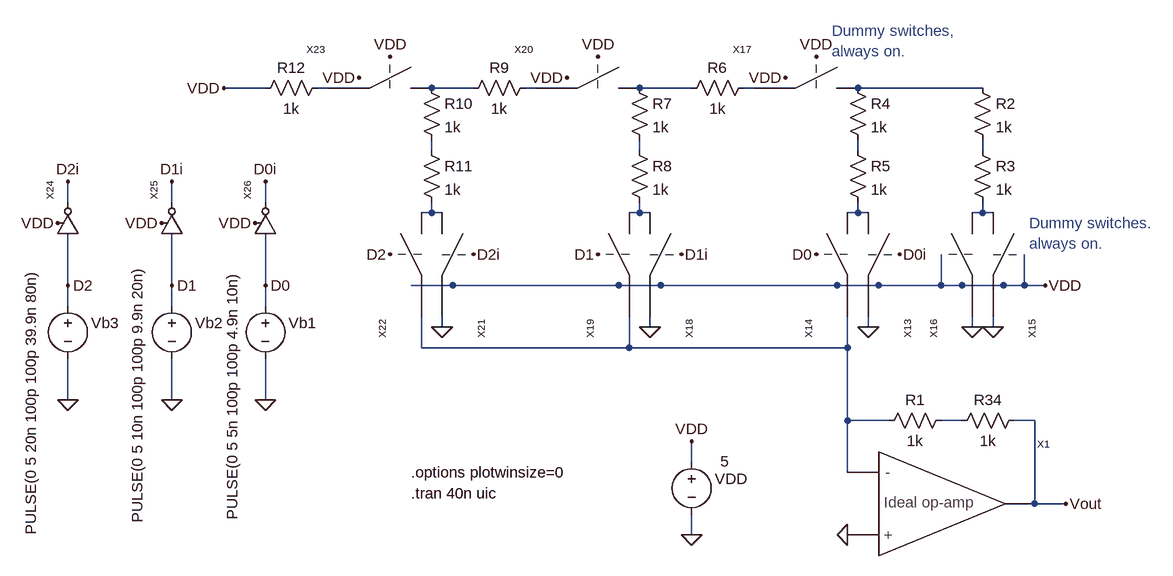
[diagram p0: schematic Fig29_8.asc]
Fig29_8.asc, the LTspice schematic file:
Version 4
SHEET 1 2492 2056
WIRE 688 960 624 960
WIRE 784 960 768 960
WIRE 1008 960 944 960
WIRE 1104 960 1088 960
WIRE 1344 960 1264 960
WIRE 1440 960 1424 960
WIRE 1792 960 1600 960
WIRE 944 1056 944 1040
WIRE 1264 1056 1264 1040
WIRE 1600 1056 1600 1040
WIRE 1792 1056 1792 1040
WIRE 384 1136 384 1104
WIRE 544 1136 544 1104
WIRE 688 1136 688 1104
WIRE 944 1152 944 1136
WIRE 944 1152 928 1152
WIRE 960 1152 944 1152
WIRE 1264 1152 1264 1136
WIRE 1264 1152 1248 1152
WIRE 1280 1152 1264 1152
WIRE 1600 1152 1600 1136
WIRE 1600 1152 1584 1152
WIRE 1616 1152 1600 1152
WIRE 1792 1152 1792 1136
WIRE 1792 1152 1776 1152
WIRE 1808 1152 1792 1152
WIRE 384 1264 384 1184
WIRE 544 1264 544 1184
WIRE 688 1264 688 1184
WIRE 976 1264 912 1264
WIRE 1232 1264 976 1264
WIRE 1296 1264 1232 1264
WIRE 1568 1264 1296 1264
WIRE 1632 1264 1568 1264
WIRE 1728 1264 1728 1216
WIRE 1728 1264 1632 1264
WIRE 1760 1264 1728 1264
WIRE 1824 1264 1760 1264
WIRE 1856 1264 1856 1216
WIRE 1856 1264 1824 1264
WIRE 1888 1264 1856 1264
WIRE 384 1296 384 1264
WIRE 544 1296 544 1264
WIRE 688 1296 688 1264
WIRE 960 1328 960 1312
WIRE 1280 1328 1280 1312
WIRE 1616 1328 1616 1312
WIRE 1776 1328 1776 1312
WIRE 1808 1328 1808 1312
WIRE 928 1360 928 1312
WIRE 1248 1360 1248 1312
WIRE 1248 1360 928 1360
WIRE 1584 1360 1584 1312
WIRE 1584 1360 1248 1360
WIRE 384 1440 384 1376
WIRE 544 1440 544 1376
WIRE 688 1440 688 1376
WIRE 1584 1472 1584 1360
WIRE 1648 1472 1584 1472
WIRE 1760 1472 1728 1472
WIRE 1872 1472 1840 1472
WIRE 1344 1536 1344 1504
WIRE 1584 1552 1584 1472
WIRE 1872 1600 1872 1472
WIRE 1920 1600 1872 1600
WIRE 1344 1648 1344 1616
FLAG 1344 1648 0
FLAG 1344 1504 VDD
FLAG 1584 1648 0
FLAG 1920 1600 Vout
FLAG 1536 1216 D0
FLAG 1664 1216 D0i
FLAG 1808 1328 0
FLAG 1776 1328 0
FLAG 1616 1328 0
FLAG 1488 944 VDD
FLAG 1536 912 VDD
FLAG 1200 1216 D1
FLAG 1328 1216 D1i
FLAG 1280 1328 0
FLAG 1152 944 VDD
FLAG 1200 912 VDD
FLAG 880 1216 D2
FLAG 1008 1216 D2i
FLAG 960 1328 0
FLAG 832 944 VDD
FLAG 880 912 VDD
FLAG 1888 1264 VDD
FLAG 624 960 VDD
FLAG 688 1440 0
FLAG 544 1440 0
FLAG 384 1440 0
FLAG 688 1264 D0
FLAG 544 1264 D1
FLAG 384 1264 D2
FLAG 368 1168 VDD
FLAG 384 1104 D2i
FLAG 528 1168 VDD
FLAG 544 1104 D1i
FLAG 672 1168 VDD
FLAG 688 1104 D0i
SYMBOL voltage 1344 1520 R0
WINDOW 0 36 42 Left 0
WINDOW 3 44 15 Left 0
WINDOW 123 0 0 Left 0
WINDOW 39 0 0 Left 0
SYMATTR InstName VDD
SYMATTR Value 5
SYMBOL Ideal_op_amp 1632 1600 R0
SYMATTR InstName X1
SYMBOL res 1632 1488 R270
WINDOW 0 32 56 VTop 0
WINDOW 3 0 56 VBottom 0
SYMATTR InstName R1
SYMATTR Value 1k
SYMBOL res 1776 944 R0
SYMATTR InstName R2
SYMATTR Value 1k
SYMBOL res 1776 1040 R0
SYMATTR InstName R3
SYMATTR Value 1k
SYMBOL res 1584 944 R0
SYMATTR InstName R4
SYMATTR Value 1k
SYMBOL res 1584 1040 R0
SYMATTR InstName R5
SYMATTR Value 1k
SYMBOL switch_1 1600 1152 R90
SYMATTR InstName X13
SYMBOL switch_1 1600 1152 M90
SYMATTR InstName X14
SYMBOL switch_1 1792 1152 R90
SYMATTR InstName X15
SYMBOL switch_1 1792 1152 M90
SYMATTR InstName X16
SYMBOL res 1328 976 R270
WINDOW 0 32 56 VTop 0
WINDOW 3 0 56 VBottom 0
SYMATTR InstName R6
SYMATTR Value 1k
SYMBOL switch_1 1600 976 M0
SYMATTR InstName X17
SYMBOL res 1248 944 R0
SYMATTR InstName R7
SYMATTR Value 1k
SYMBOL res 1248 1040 R0
SYMATTR InstName R8
SYMATTR Value 1k
SYMBOL switch_1 1264 1152 R90
SYMATTR InstName X18
SYMBOL switch_1 1264 1152 M90
SYMATTR InstName X19
SYMBOL res 992 976 R270
WINDOW 0 32 56 VTop 0
WINDOW 3 0 56 VBottom 0
SYMATTR InstName R9
SYMATTR Value 1k
SYMBOL switch_1 1264 976 M0
SYMATTR InstName X20
SYMBOL res 928 944 R0
SYMATTR InstName R10
SYMATTR Value 1k
SYMBOL res 928 1040 R0
SYMATTR InstName R11
SYMATTR Value 1k
SYMBOL switch_1 944 1152 R90
SYMATTR InstName X21
SYMBOL switch_1 944 1152 M90
SYMATTR InstName X22
SYMBOL res 672 976 R270
WINDOW 0 32 56 VTop 0
WINDOW 3 0 56 VBottom 0
SYMATTR InstName R12
SYMATTR Value 1k
SYMBOL switch_1 944 976 M0
SYMATTR InstName X23
SYMBOL res 1744 1488 R270
WINDOW 0 32 56 VTop 0
WINDOW 3 0 56 VBottom 0
SYMATTR InstName R34
SYMATTR Value 1k
SYMBOL voltage 688 1280 R0
WINDOW 0 36 42 Left 0
WINDOW 3 -51 345 VLeft 0
WINDOW 123 0 0 Left 0
WINDOW 39 0 0 Left 0
SYMATTR InstName Vb1
SYMATTR Value PULSE(0 5 5n 100p 100p 4.9n 10n)
SYMBOL voltage 544 1280 R0
WINDOW 0 36 42 Left 0
WINDOW 3 -53 350 VLeft 0
WINDOW 123 0 0 Left 0
WINDOW 39 0 0 Left 0
SYMATTR InstName Vb2
SYMATTR Value PULSE(0 5 10n 100p 100p 9.9n 20n)
SYMBOL voltage 384 1280 R0
WINDOW 0 36 42 Left 0
WINDOW 3 -57 368 VLeft 0
WINDOW 123 0 0 Left 0
WINDOW 39 0 0 Left 0
SYMATTR InstName Vb3
SYMATTR Value PULSE(0 5 20n 100p 100p 39.9n 80n)
SYMBOL inverter 384 1184 R270
SYMATTR InstName X24
SYMBOL inverter 544 1184 R270
SYMATTR InstName X25
SYMBOL inverter 688 1184 R270
SYMATTR InstName X26
TEXT 912 1584 Left 0 !.tran 40n uic
TEXT 912 1552 Left 0 !.options plotwinsize=0
TEXT 1560 872 Left 0 ;Dummy switches,\nalways on.
TEXT 1864 1168 Left 0 ;Dummy switches.\nalways on.

The netlist it stands for:
* Fig29_8.asc
VDD VDD 0 5
XX1 N015 0 Vout Ideal_op_amp  ; pins Vinm Vinp Out
R1 N015 N016 1k
R2 N006 N010 1k
R3 N010 N014 1k
R4 N006 N009 1k
R5 N009 N013 1k
XX13 N013 0 D0i VDD switch_1  ; pins P1 P2 clk VDD
XX14 N013 N015 D0 VDD switch_1  ; pins P1 P2 clk VDD
XX15 N014 0 VDD VDD switch_1  ; pins P1 P2 clk VDD
XX16 N014 0 VDD VDD switch_1  ; pins P1 P2 clk VDD
R6 N004 N005 1k
XX17 N006 N005 VDD VDD switch_1  ; pins P1 P2 clk VDD
R7 N004 N008 1k
R8 N008 N012 1k
XX18 N012 0 D1i VDD switch_1  ; pins P1 P2 clk VDD
XX19 N012 N015 D1 VDD switch_1  ; pins P1 P2 clk VDD
R9 N002 N003 1k
XX20 N004 N003 VDD VDD switch_1  ; pins P1 P2 clk VDD
R10 N002 N007 1k
R11 N007 N011 1k
XX21 N011 0 D2i VDD switch_1  ; pins P1 P2 clk VDD
XX22 N011 N015 D2 VDD switch_1  ; pins P1 P2 clk VDD
R12 VDD N001 1k
XX23 N002 N001 VDD VDD switch_1  ; pins P1 P2 clk VDD
R34 N016 Vout 1k
Vb1 D0 0 PULSE(0 5 5n 100p 100p 4.9n 10n)
Vb2 D1 0 PULSE(0 5 10n 100p 100p 9.9n 20n)
Vb3 D2 0 PULSE(0 5 20n 100p 100p 39.9n 80n)
XX24 D2 D2i VDD inverter  ; pins In Out VDD
XX25 D1 D1i VDD inverter  ; pins In Out VDD
XX26 D0 D0i VDD inverter  ; pins In Out VDD
.tran 40n uic
.options plotwinsize=0
* Dummy switches,
* always on.
* Dummy switches.
* always on.
.backanno
.end